# Altium schematic sheet motion sensor circuit.SchDoc: Motion sensing circuit
size A4; Revision: 1.0.0; SheetNumber: 1; SheetTotal: 3
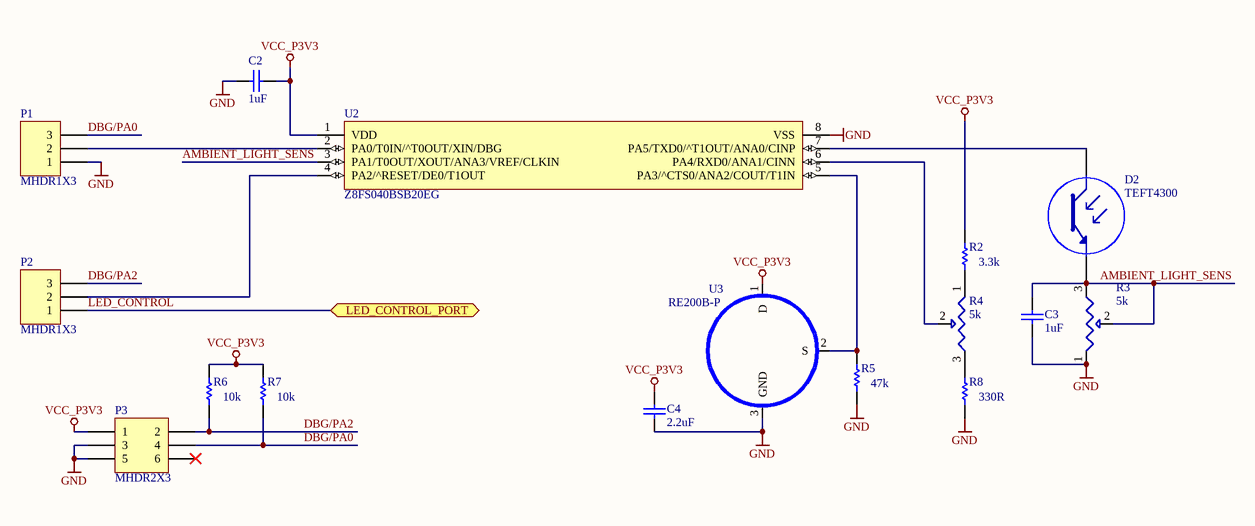
[diagram p0: motion sensor circuit.SchDoc]

## Parts
C2  value 1uF  [1608[0603]]  (hidden comment: C0603C105K8PACTU)
C3  value 1uF  [1608[0603]]  (hidden comment: C0603C105K8PACTU)
C4  value 2.2uF  [1608[0603]]  (hidden comment: C0603C225K8PACTU)
D2  TEFT4300  [LED]
P1  MHDR1X3  [MHDR1X3]
P2  MHDR1X3  [MHDR1X3]
P3  MHDR2X3  [MHDR2X3]
R2  value 3.3k  [3-0603]  (hidden comment: ERJ-3GEYJ332V)
R3  value 5k  [3386F]  (hidden comment: 3386F-1-502)
R4  value 5k  [3386F]  (hidden comment: 3386F-1-502)
R5  value 47k  [3-0603]  (hidden comment: ERJ-3GEYJ473V)
R6  value 10k  [3-0603]  (hidden comment: ERJ-3GEYJ103V)
R7  value 10k  [3-0603]  (hidden comment: ERJ-3GEYJ103V)
R8  value 330R  [3-0603]  (hidden comment: ERJ-3GEYJ331V)
U2  Z8FS040BSB20EG  [SOIC127P600X173-8N]
U3  RE200B-P  [RE200B-P]

## Ports
LED_CONTROL_PORT

## Nets
GND: C2.2 C3.2 C4.2 P1.1 P3.3 P3.5 R3.1 R5.1 R8.1 U2.8(VSS) U3.3(GND)
VCC_P3V3: C2.1 C4.1 P3.1 R2.2 R6.2 R7.2 U2.1(VDD) U3.1(D)
AMBIENT_LIGHT_SENS: C3.1 D2.2 R3.2 R3.3 U2.3(PA1/T0OUT/XOUT/ANA3/VREF/CLKIN)
DBG/PA0: P1.3 P3.4 R7.1
DBG/PA2: P2.3 P3.2 R6.1
LED_CONTROL: P2.1 ; port LED_CONTROL_PORT
NetD2_1: D2.1 U2.7(PA5/TXD0/^T1OUT/ANA0/CINP)
NetP1_2: P1.2 U2.2(PA0/T0IN/^T0OUT/XIN/DBG)
NetP2_2: P2.2 U2.4(PA2/^RESET/DE0/T1OUT)
NetR2_1: R2.1 R4.1
NetR4_2: R4.2 U2.6(PA4/RXD0/ANA1/CINN)
NetR4_3: R4.3 R8.2
NetR5_2: R5.2 U2.5(PA3/^CTS0/ANA2/COUT/T1IN) U3.2(S)

Not connected (* = marked no-connect by the designer): P3 6*

## Notes on the sheet
- Title
- Size:
- Date:
- A4
- Number:
- Time:
- Revision:
- Sheet
- of
- File:

## Library data of the parts
C2-C4 = C0603: Ceramic Chip Capacitor - Standard; Note: Footprint corresponds to dimensions for bulk cassette packaging. This case size has tightened tolerances.; Published: 17-Jul-2002; LatestRevisionDate: 19-Mar-2004; LatestRevisionNote: Silkscreen size reduced.; DatasheetDocument: Mar-2001; PackageDocument: Mar-2001; PackageReference: 0603; Publisher: Altium Limited; Code_JEITA: 0603; Code_IPC: 1608 [0603]; ComponentLink1Description: Manufacturer Link; ComponentLink1URL: http://www.kemet.com/; ComponentLink2Description: Datasheet; ComponentLink2URL: http://www.kemet.com/kemet/web/homepage/kechome.nsf/vapubfilesname/F3102TA.pdf/$file/F3102TA.pdf
D2 = TEFT4300: Silicon NPN Phototransistor
P1 P2 = MHDR1X3: Header, 3-Pin; LatestRevisionDate: 17-Jul-2002; LatestRevisionNote: Re-released for DXP Platform.; Publisher: Altium Limited
P3 = MHDR2X3: Header, 3-Pin, Dual row; LatestRevisionDate: 17-Jul-2002; LatestRevisionNote: Re-released for DXP Platform.; Publisher: Altium Limited
R2 R5-R8 = ERJ3EK: Precision Thick Film Chip Resistor, 10 Ohm to 1M Ohm Range, 1% and 0.5% Tolerance, 0603 Size, 0.063 W; Published: 17-Dec-2003; LatestRevisionDate: 19-Mar-2004; LatestRevisionNote: Silkscreen size reduced.; PackageDocument: Mar-2003; PackageReference: 3-0603; Publisher: Altium Limited; Code_IPC: 1608 [0603]; ComponentLink1Description: Manufacturer Link; ComponentLink1URL: http://www.panasonic.com/industrial/components/resistive_products.htm; ComponentLink2Description: Datasheet; ComponentLink2URL: http://www.panasonic.com/industrial/components/pdf/AOA0000CE2.pdf
R3 R4 = 3386F-1-XXX: 3386 - 3/8 ” Square Trimpot Trimming Potentiometer
U2 = Z8FS040BSB20EG: 8-bit Microcontrollers - MCU ZMotion MCU Mot Det IC, 4KB Flash
U3 = RE200B-P: Pyroelectric Passive Infrared Sensor